# EAGLE design CombinedBoard_revA.1 (EAGLE 9.1.0)
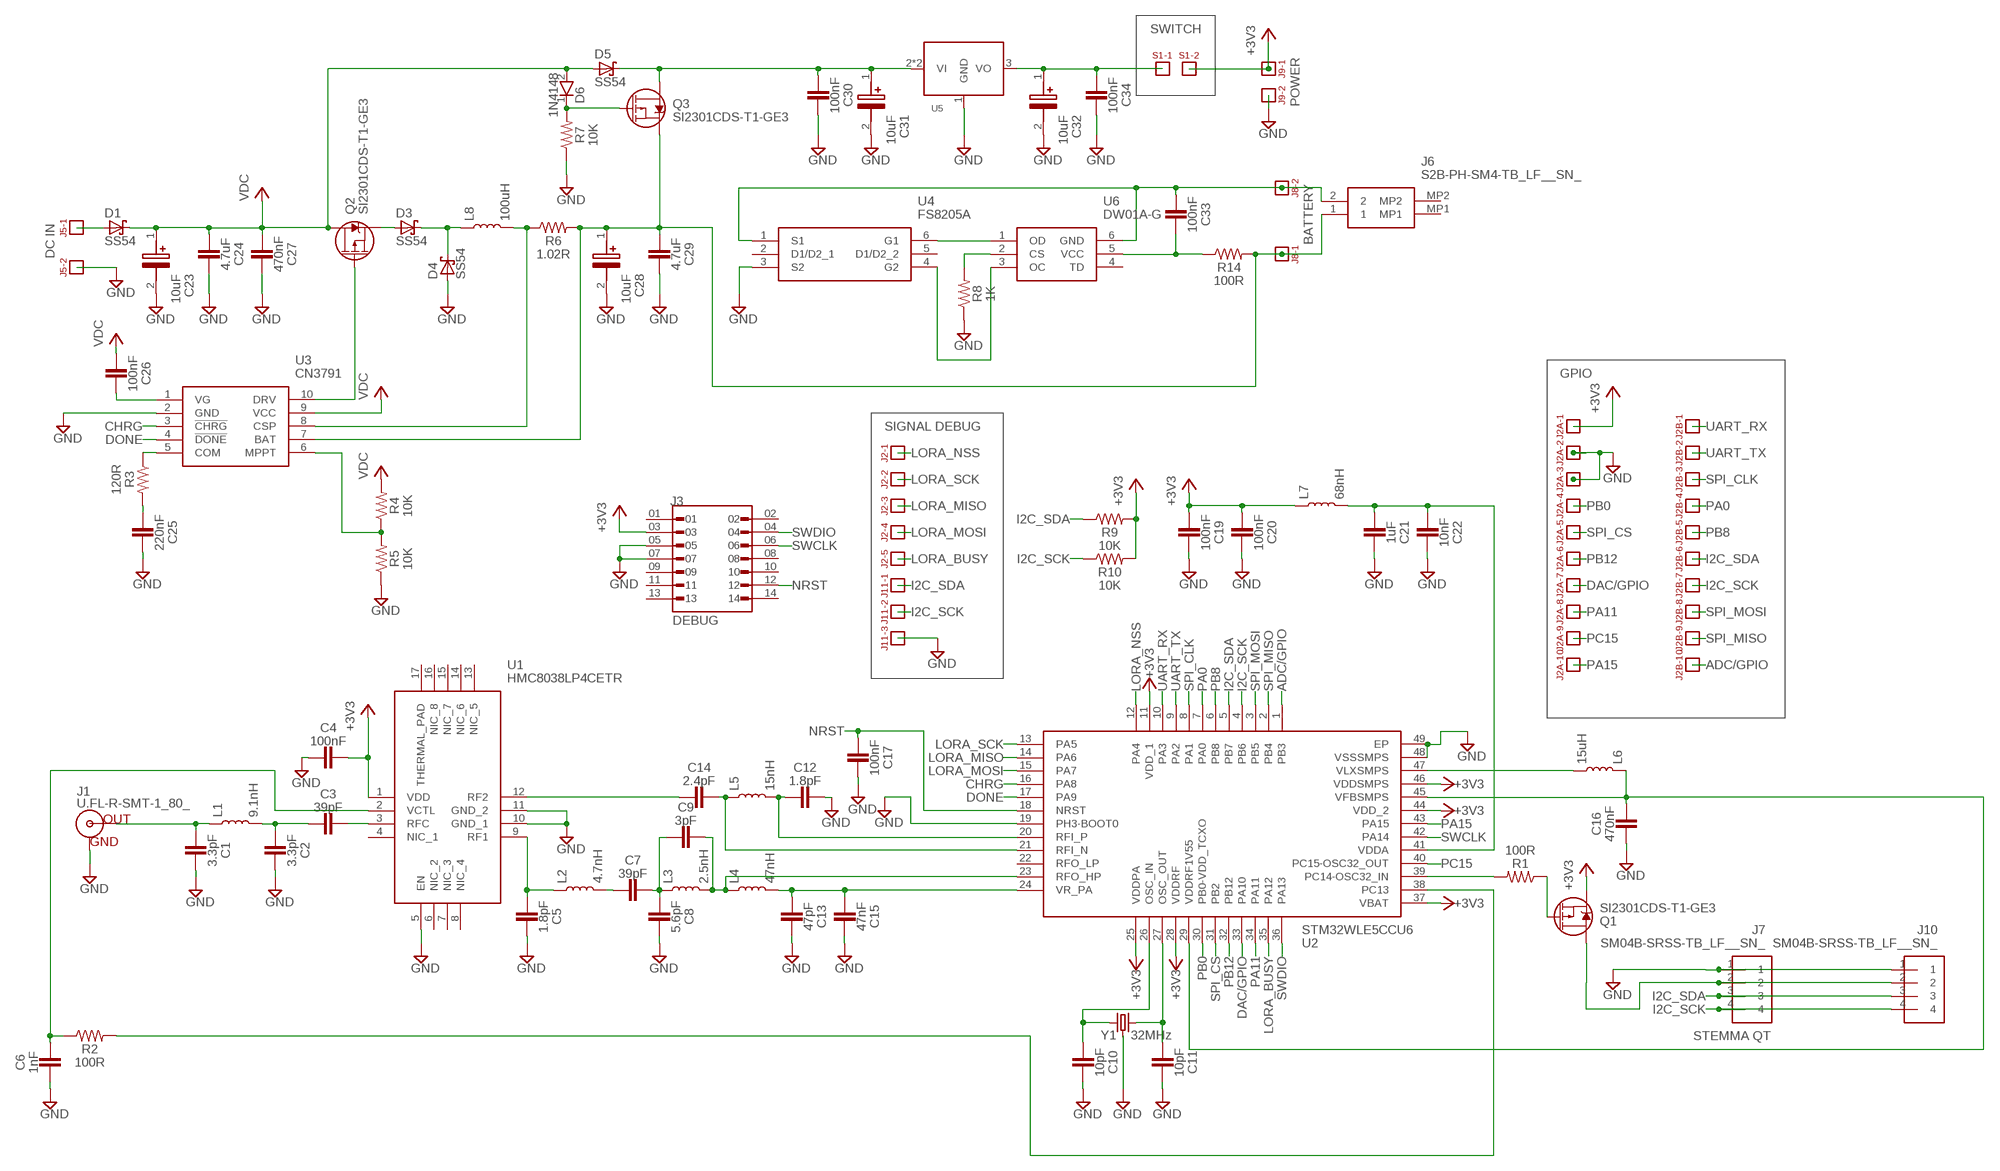
[diagram p0: schematic, sheet 1]

## Parts
C1  3.3pF  C_0402  [0402]
C2  3.3pF  C_0402  [0402]
C3  39pF  C_0402  [0402]
C4  100nF  C_0402  [0402]
C5  1.8pF  C_0402  [0402]
C6  1nF  C_0603  [0603]
C7  39pF  C_0402  [0402]
C8  5.6pF  C_0402  [0402]
C9  3pF  C_0603  [0603]
C10  10pF  C_0402  [0402]
C11  10pF  C_0402  [0402]
C12  1.8pF  C_0402  [0402]
C13  47pF  C_0603  [0603]
C14  2.4pF  C_0402  [0402]
C15  47nF  C_0603  [0603]
C16  470nF  C_0402  [0402]
C17  100nF  C_0402  [0402]
C19  100nF  C_0402  [0402]
C20  100nF  C_0402  [0402]
C21  1uF  C_0402  [0402]
C22  10nF  C_0402  [0402]
C23  10uF  4MM_SMD_ECAP  [4MM_SMD_ECAP]
C24  4.7uF  C_1206  [1206]
C25  220nF  C_0603  [0603]
C26  100nF  C_0402  [0402]
C27  470nF  C_0805  [0805]
C28  10uF  4MM_SMD_ECAP  [4MM_SMD_ECAP]
C29  4.7uF  C_1206  [1206]
C30  100nF  C_0402  [0402]
C31  10uF  4MM_SMD_ECAP  [4MM_SMD_ECAP]
C32  10uF  4MM_SMD_ECAP  [4MM_SMD_ECAP]
C33  100nF  C_0402  [0402]
C34  100nF  C_0402  [0402]
D1  SS54  DIODE_SCHOTTKY_SMA  [SMA(DO-214AC)]
D3  SS54  DIODE_SCHOTTKY_SMA  [SMA(DO-214AC)]
D4  SS54  DIODE_SCHOTTKY_SMA  [SMA(DO-214AC)]
D5  SS54  DIODE_SCHOTTKY_SMA  [SMA(DO-214AC)]
D6  1N4148  1N4148W  [SOD3716X135N]
J1  U.FL-R-SMT-1_80_  [UFLRSMT180]
J2  HEADER_5PIN  [HEADER_5PIN]
J2A  HEADER_10PIN  [HEADER_10PIN]
J2B  HEADER_10PIN  [HEADER_10PIN]
J3  DEBUG  HEADER_DEBUG_SMD  [HEADER_DEBUG_SMD]
J5  SOLAR  HEADER_2PIN  [HEADER_2PIN]
J6  S2B-PH-SM4-TB_LF__SN_  [S2BPHSM4TBLFSN]
J7  SM04B-SRSS-TB_LF__SN_  [SM04B-SRSS-TB(LFSN)]
J8  BATTERY  HEADER_2PIN  [HEADER_2PIN]
J9  POWER  HEADER_2PIN  [HEADER_2PIN]
J10  SM04B-SRSS-TB_LF__SN_  [SM04B-SRSS-TB(LFSN)]
J11  HEADER_3PIN  [HEADER_3PIN]
L1  9.1nH  L_0402  [0402]
L2  4.7nH  L_0402  [0402]
L3  2.5nH  L_0402  [0402]
L4  47nH  L_0603  [0603]
L5  15nH  L_0402  [0402]
L6  15uH  L_0805  [0805]
L7  68nH  L_0603  [0603]
L8  100uH  L_SMD,7X7.8MM  [L_SMD,7X7.8MM]
Q1  SI2301CDS-T1-GE3  MOSFET_P_SOT23  [SOT-23]
Q2  SI2301CDS-T1-GE3  MOSFET_P_SOT23  [SOT-23]
Q3  SI2301CDS-T1-GE3  MOSFET_P_SOT23  [SOT-23]
R1  100R  R_0402  [0402]
R2  100R  R_0402  [0402]
R3  120R  R_0805  [0805]
R4  10K  R_0402  [0402]
R5  10K  R_0402  [0402]
R6  1.02R  R_1206  [1206]
R7  10K  R_0402  [0402]
R8  1K  R_0402  [0402]
R9  10K  R_0402  [0402]
R10  10K  R_0402  [0402]
R14  100R  R_0402  [0402]
S1  HEADER_2PIN  [HEADER_2PIN]
U1  HMC8038LP4CETR  [QFN65P400X400X90-17N]
U2  STM32WLE5CCU6  [QFN50P700X700X60-49N]
U3  CN3791  [SOP100P600X175-10N]
U4  FS8205A  [SOT95P280X125-6N]
U5  LDO_SOT89  [SOT-89-3]
U6  DW01A-G  [SOT95P280X135-6N]
Y1  32MHz  XTAL_SMD2016-4P  [SMD2016-4P]

## Nets
+3V3: C4.2 C19.1 C20.1 J2A.P$1 J3.03 J9.P$1 L7.1 Q1.3(S) R9.2 R10.2 S1.P$2 U1.1(VDD) U2.11(VDD_1) U2.25(VDDPA) U2.28(VDDRF) U2.37(VBAT) U2.44(VDD_2) U2.46(VDDSMPS)
ADC/GPIO: J2B.P$10 U2.1(PB3)
B+: C28.1(+) C29.1 J6.1 J8.P$1 Q3.3(S) R6.2 R14.2 U3.7(BAT)
B-: C33.1 J6.2 J8.P$2 U4.1(S1) U6.6(GND)
CHRG: U2.16(PA8) U3.3(!CHRG)
DAC/GPIO: J2A.P$7 U2.33(PA10)
DONE: U2.17(PA9) U3.4(!DONE)
GND: C1.2 C2.2 C4.1 C5.2 C6.1 C8.2 C10.2 C11.2 C12.2 C13.2 C15.2 C16.1 C17.2 C19.2 C20.2 C21.2 C22.2 C23.2(-) C24.2 C25.2 C27.2 C28.2(-) C29.2 C30.2 C31.2(-) C32.2(-) C34.2 D4.2(A) J1.2(GND) J1.3(GND) J2A.P$2 J2A.P$3 J3.05 J3.07 J5.P$2 J7.1 J9.P$2 J10.1 J11.P$3 R5.1 R7.1 R8.1 U1.5(EN) U1.10(GND_1) U1.11(GND_2) U2.19(PH3-BOOT0) U2.48(VSSSMPS) U2.49(EP) U3.2(GND) U4.3(S2) U5.1(GND) Y1.2 Y1.4
I2C_SCK: J2B.P$7 J7.4 J10.4 J11.P$2 R10.1 U2.4(PB6)
I2C_SDA: J2B.P$6 J7.3 J10.3 J11.P$1 R9.1 U2.5(PB7)
LORA_BUSY: J2.P$5 U2.35(PA12)
LORA_MISO: J2.P$3 U2.14(PA6)
LORA_MOSI: J2.P$4 U2.15(PA7)
LORA_NSS: J2.P$1 U2.12(PA4)
LORA_SCK: J2.P$2 U2.13(PA5)
N$1: D3.2(A) Q2.3(S)
N$2: C9.2 L3.2 L4.1 U2.23(RFO_HP)
N$3: C14.2 L5.1 U2.21(RFI_N)
N$4: L6.2 U2.47(VLXSMPS)
N$5: R2.2 U2.38(PC13)
N$6: D6.1(K) Q3.1(G) R7.2
N$7: D1.2(A) J5.P$1
N$8: R1.2 U2.39(PC14-OSC32_IN)
N$9: Q1.1(G) R1.1
N$10: C32.1(+) C34.1 S1.P$1 U5.3(VO)
N$12: J7.2 J10.2 Q1.2(D)
N$23: D3.1(C) D4.1(C) L8.P$1
N$24: L8.P$2 R6.1 U3.8(CSP)
N$25: C30.1 C31.1(+) D5.1(C) Q3.2(D) U5.2(VI) U5.4(VI)
N$26: Q2.1(G) U3.10(DRV)
N$27: R3.1 U3.5(COM)
N$28: C25.1 R3.2
N$31: C26.2 U3.1(VG)
N$32: R4.1 R5.2 U3.6(MPPT)
N$33: R8.2 U6.2(CS)
N$34: U4.4(G2) U6.3(OC)
N$35: U4.6(G1) U6.1(OD)
N$37: C33.2 R14.1 U6.5(VCC)
N$49: C1.1 J1.1(OUT) L1.1
N$50: C2.1 C3.1 L1.2
N$51: C3.2 U1.3(RFC)
N$52: C6.2 R2.1 U1.2(VCTL)
N$53: C14.1 U1.12(RF2)
N$54: C5.1 L2.1 U1.9(RF1)
N$55: C7.1 L2.2
N$56: C7.2 C8.1 C9.1 L3.1
NRST: C17.1 J3.12 U2.18(NRST)
OSC_IN: C10.1 U2.26(OSC_IN) Y1.1
OSC_OUT: C11.1 U2.27(OSC_OUT) Y1.3
PA0: J2B.P$4 U2.7(PA0)
PA11: J2A.P$8 U2.34(PA11)
PA15: J2A.P$10 U2.43(PA15)
PB0: J2A.P$4 U2.30(PB0-VDD_TCXO)
PB8: J2B.P$5 U2.6(PB8)
PB12: J2A.P$6 U2.32(PB12)
PC15: J2A.P$9 U2.40(PC15-OSC32_OUT)
RFI_3: C12.1 L5.2 U2.20(RFI_P)
SPI_CLK: J2B.P$3 U2.8(PA1)
SPI_CS: J2A.P$5 U2.31(PB2)
SPI_MISO: J2B.P$9 U2.2(PB4)
SPI_MOSI: J2B.P$8 U2.3(PB5)
SWCLK: J3.06 U2.42(PA14)
SWDIO: J3.04 U2.36(PA13)
UART_RX: J2B.P$1 U2.10(PA3)
UART_TX: J2B.P$2 U2.9(PA2)
VDC: C23.1(+) C24.1 C26.1 C27.1 D1.1(C) D5.2(A) D6.2(A) Q2.2(D) R4.2 U3.9(VCC)
VDDA: C21.1 C22.1 L7.2 U2.41(VDDA)
VR_PA1: C13.1 C15.1 L4.2 U2.24(VR_PA)
VREG1: C16.2 L6.1 U2.29(VDDRF1V55) U2.45(VFBSMPS)
Unconnected: J3.01 J3.02 J3.08 J3.09 J3.10 J3.11 J3.13 J3.14 J6.MP1 J6.MP2 U1.4(NIC_1) U1.6(NIC_2) U1.7(NIC_3) U1.8(NIC_4) U1.13(NIC_5) U1.14(NIC_6) U1.15(NIC_7) U1.16(NIC_8) U1.17(THERMAL_PAD) U2.22(RFO_LP) U4.2(D1/D2_1) U4.5(D1/D2_2) U6.4(TD)

## Notes on the sheet
- SWITCH
- POWER
- BATTERY
- DC IN
- GPIO
- SIGNAL DEBUG
- STEMMA QT

## Library data of the parts
C1-C5 C7 C8 C10-C12 C14 C16 C17 C19-C22 C26 C30 C33 C34 = NSE LABS:C_0402: Samsung Source: Datasheet <https://datasheet.lcsc.com/szlcsc/Samsung-Electro-Mechanics-CL05B104KB54PNC_C307331.pdf>
C6 C9 C13 C15 C25 = NSE LABS:C_0603
C23 C28 C31 C32 = NSE LABS:4MM_SMD_ECAP
C24 C29 = NSE LABS:C_1206
C27 = NSE LABS:C_0805
D1 D3-D5 = NSE LABS:DIODE_SCHOTTKY_SMA
D6 = MARA MACHINES:1N4148W: Diode Switching 100V 0.15A SOD123 Vishay 1N4148W-E3-08 Switching Diode, 150mA 75V, 2-Pin SOD-123 Source: Datasheet <http://www.vishay.com/docs/85748/1n4148w.pdf>; ARROW_PART_NUMBER: 1N4148W-E3-08; ARROW_PRICE-STOCK: https://www.arrow.com/en/products/1n4148w-e3-08/vishay; DESCRIPTION: Diode Switching 100V 0.15A SOD123 Vishay 1N4148W-E3-08 Switching Diode, 150mA 75V, 2-Pin SOD-123; HEIGHT: 1.35mm; MANUFACTURER_NAME: Vishay; MANUFACTURER_PART_NUMBER: 1N4148W-E3-08; MOUSER_PART_NUMBER: 78-1N4148W-E3-08; MOUSER_PRICE-STOCK: https://www.mouser.co.uk/ProductDetail/Vishay-Semiconductors/1N4148W-E3-08/?qs=bTzheeSci6TVjpxfjjRVMw%3D%3D
J1 = NSE LABS:U.FL-R-SMT-1_80_: RF Connectors/Coaxial Connectors SMD RoHS Source: Datasheet <https://www.hirose.com/product/download/?distributor=digikey&type=2d&lang=en&num=U.FL-R-SMT-1(80)>; DESCRIPTION: RF Connectors/Coaxial Connectors SMD RoHS; HEIGHT: 1.45mm; MANUFACTURER_NAME: Hirose; MANUFACTURER_PART_NUMBER: U.FL-R-SMT-1(80); MOUSER_PART_NUMBER: 798-UFLRSMT180; MOUSER_PRICE-STOCK: https://www.mouser.co.uk/ProductDetail/Hirose-Connector/U.FL-R-SMT-180?qs=PABxe4V6HDqFClp15N8Kig%3D%3D
J2 = NSE LABS:HEADER_5PIN
J2A J2B = NSE LABS:HEADER_10PIN
J3 = NSE LABS:HEADER_DEBUG_SMD
J5 J8 J9 S1 = NSE LABS:HEADER_2PIN
J6 = NSE LABS:S2B-PH-SM4-TB_LF__SN_: Conn Shrouded Header (4 Sides) HDR 2 POS 2mm Solder RA Side Entry SMD T/R Source: Datasheet <https://www.jst-mfg.com/product/pdf/eng/ePH.pdf>; ARROW_PART_NUMBER: S2B-PH-SM4-TB(LF)(SN); ARROW_PRICE-STOCK: https://www.arrow.com/en/products/s2b-ph-sm4-tb-lf-sn/jst-manufacturing?region=europe; DESCRIPTION: Conn Shrouded Header (4 Sides) HDR 2 POS 2mm Solder RA Side Entry SMD T/R; HEIGHT: 6.6mm; MANUFACTURER_NAME: JST (JAPAN SOLDERLESS TERMINALS); MANUFACTURER_PART_NUMBER: S2B-PH-SM4-TB(LF)(SN)
J7 J10 = NSE LABS:SM04B-SRSS-TB_LF__SN_: JST (JAPAN SOLDERLESS TERMINALS) - SM04B-SRSS-TB(LF)(SN) - CONNECTOR, HEADER, SMT, R/A, 1MM, 4WAY Source: Datasheet <http://www.jst-mfg.com/product/pdf/eng/eSH.pdf>; ARROW_PART_NUMBER: SM04B-SRSS-TB(LF)(SN); ARROW_PRICE-STOCK: https://www.arrow.com/en/products/sm04b-srss-tb-lf-sn/jst-manufacturing?region=europe; DESCRIPTION: JST (JAPAN SOLDERLESS TERMINALS) - SM04B-SRSS-TB(LF)(SN) - CONNECTOR, HEADER, SMT, R/A, 1MM, 4WAY; HEIGHT: mm; MANUFACTURER_NAME: JST (JAPAN SOLDERLESS TERMINALS); MANUFACTURER_PART_NUMBER: SM04B-SRSS-TB(LF)(SN)
J11 = NSE LABS:HEADER_3PIN
L1-L3 L5 = NSE LABS:L_0402
L4 L7 = NSE LABS:L_0603
L6 = NSE LABS:L_0805
L8 = NSE LABS:L_SMD,7X7.8MM
Q1-Q3 = NSE LABS:MOSFET_P_SOT23
R1 R2 R4 R5 R7-R10 R14 = NSE LABS:R_0402
R3 = NSE LABS:R_0805
R6 = NSE LABS:R_1206
U1 = NSE LABS:HMC8038LP4CETR: RF Switch ICs High isolation, non-reflective, single s Source: Datasheet <https://pt.mouser.com/datasheet/2/609/HMC8038W-2956082.pdf>; ARROW_PART_NUMBER: HMC8038LP4CETR; ARROW_PRICE-STOCK: https://www.arrow.com/en/products/hmc8038lp4cetr/analog-devices?region=nac; DESCRIPTION: RF Switch ICs High isolation, non-reflective, single s; HEIGHT: 0.9mm; MANUFACTURER_NAME: Analog Devices; MANUFACTURER_PART_NUMBER: HMC8038LP4CETR; MOUSER_PART_NUMBER: 584-HMC8038LP4CETR; MOUSER_PRICE-STOCK: https://www.mouser.co.uk/ProductDetail/Analog-Devices/HMC8038LP4CETR?qs=JeIcUl65ClBZnat%2FltI6ww%3D%3D
U2 = NSE LABS:STM32WLE5CCU6: STM32WLE5CCU6 Source: Datasheet <https://www.mouser.ch/datasheet/2/389/stm32wle5c8-1903151.pdf>; ARROW_PART_NUMBER: STM32WLE5CCU6; ARROW_PRICE-STOCK: https://www.arrow.com/en/products/stm32wle5ccu6/stmicroelectronics?region=nac; DESCRIPTION: STM32WLE5CCU6; HEIGHT: 0.6mm; MANUFACTURER_NAME: STMicroelectronics; MANUFACTURER_PART_NUMBER: STM32WLE5CCU6; MOUSER_PART_NUMBER: 511-STM32WLE5CCU6; MOUSER_PRICE-STOCK: https://www.mouser.co.uk/ProductDetail/STMicroelectronics/STM32WLE5CCU6?qs=26oI9%252Bq63sLM90C6xjPI1g%3D%3D
U3 = NSE LABS:CN3791: ic Source: Datasheet <http://www.consonance-elec.com/pdf/datasheet/DSE-CN3791.pdf>; DESCRIPTION: ic; HEIGHT: 1.75mm; MANUFACTURER_NAME: Consonance; MANUFACTURER_PART_NUMBER: CN3791
U4 = NSE LABS:FS8205A: Dual N-Channel Enhancement Power Mosfet Source: Datasheet <http://www.techpublic.com.tw/pdf/FS8205A.pdf>; DESCRIPTION: Dual N-Channel Enhancement Power Mosfet; HEIGHT: 1.25mm; MANUFACTURER_NAME: TECH PUBLIC; MANUFACTURER_PART_NUMBER: FS8205A
U5 = NSE LABS:LDO_SOT89
U6 = NSE LABS:DW01A-G: One Cell Lithium-ion/Polymer Battery Protection IC Source: Datasheet <http://acoptex.com/uploads/DW01A.pdf>; DESCRIPTION: One Cell Lithium-ion/Polymer Battery Protection IC; HEIGHT: 1.35mm; MANUFACTURER_NAME: Fortune Semiconductor Corporation; MANUFACTURER_PART_NUMBER: DW01A-G
Y1 = NSE LABS:XTAL_SMD2016-4P

## Board
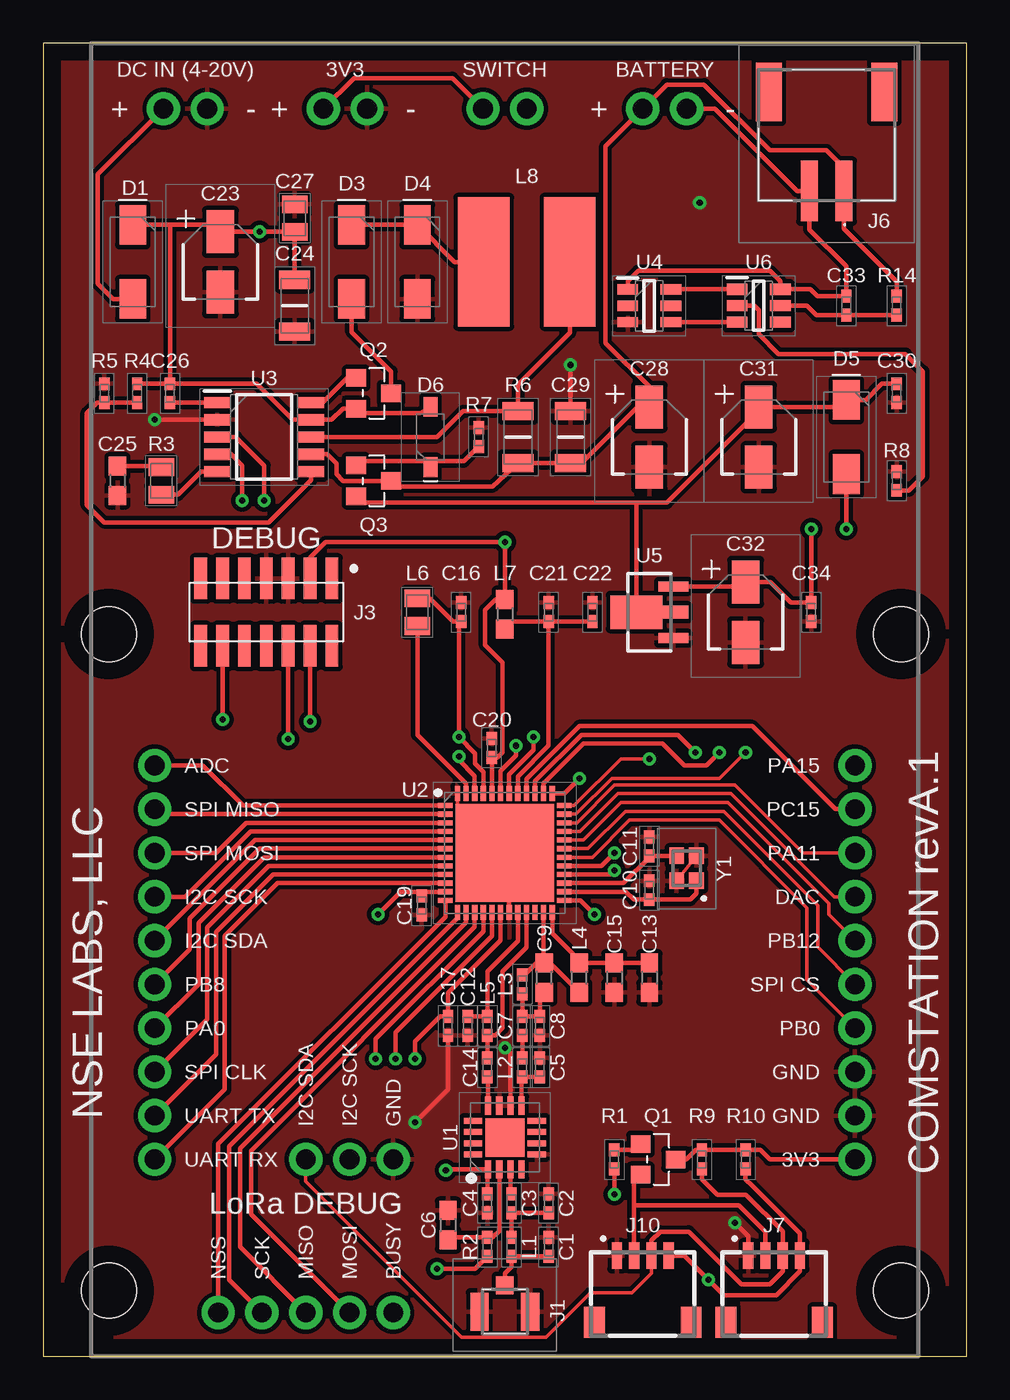
[diagram p1: board, top side]
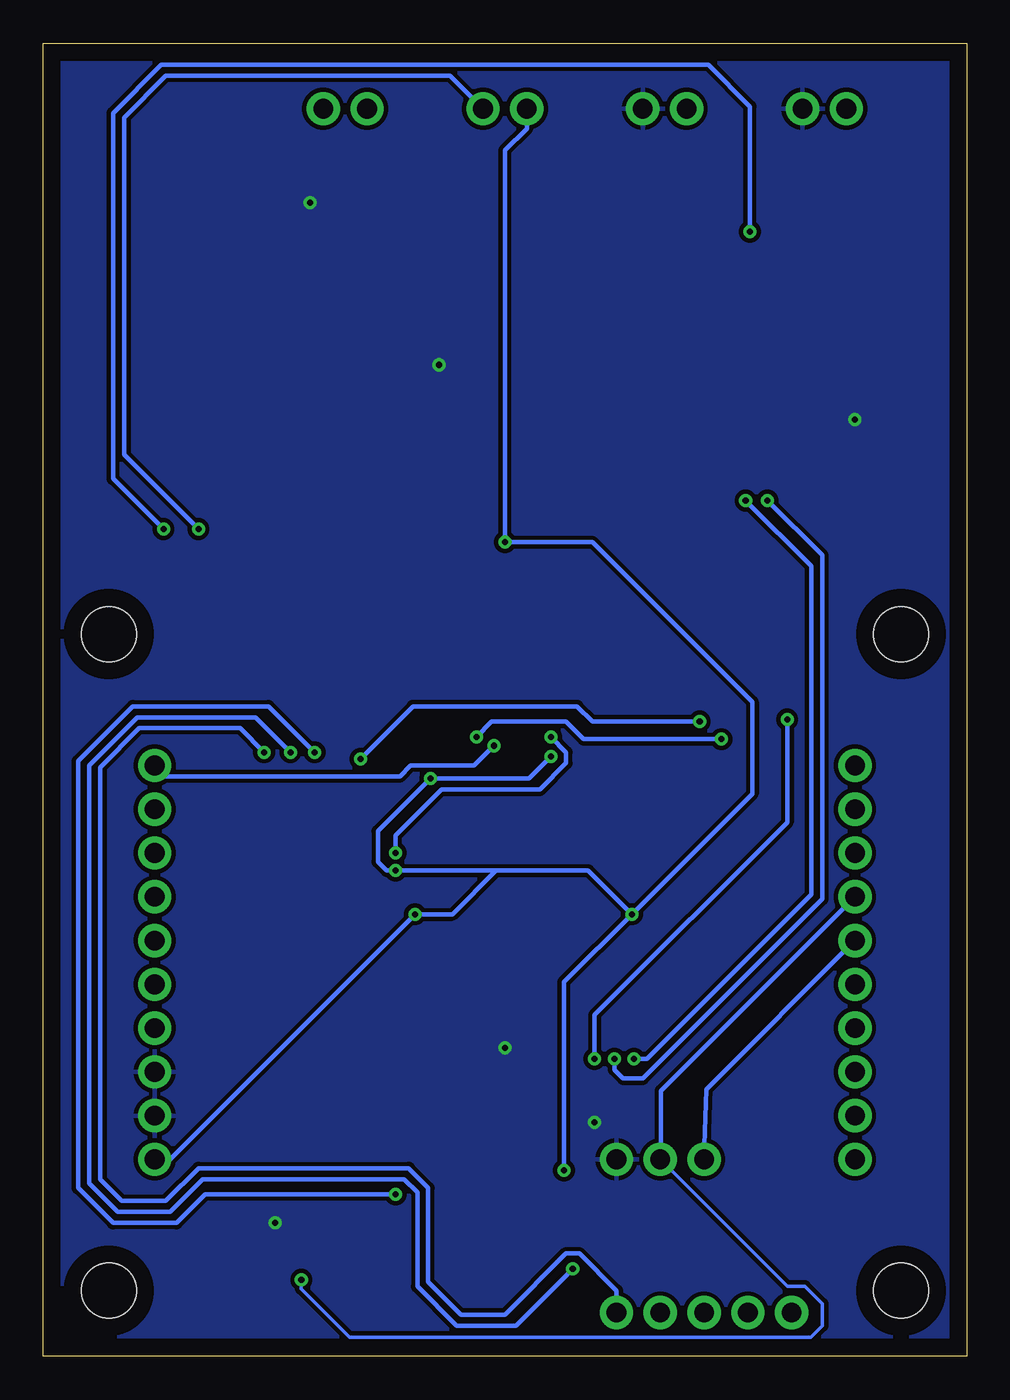
[diagram p2: board, bottom side, seen from below]

Size 53.59 x 76.2 mm. Coordinates in mm from the lower left corner, seen from the top.
Outline: 0,0 53.59,0 53.59,76.2 0,76.2 0,0
Copper layers (1*16): Top 0.035mm / dielectric 1.5mm / Bottom 0.035mm
Design rules "default": minimum track width 6mil, minimum drill 0.35mm, track to track 6mil, track to pad 6mil, pad to pad 6mil, via to via 6mil, smd to smd 6mil, copper to edge 40mil, drill to drill 6mil, minimum pad ring 10mil, minimum via ring 8mil, stop-mask expansion 4mil, vias tented up to drill 0mil, thermal gap 10mil
Holes 3.17 mm at 49.78,3.81 49.78,41.91 3.81,41.91 3.81,3.81

### Footprints (pad centres in the part's own frame; a part is rotated, then mirrored left to right if it is on the bottom)
0402 = smd 0.75 x 0.6: 1 -0.55,0; 2 0.55,0
0603 = smd 1.1 x 1: 1 -0.85,0; 2 0.85,0
4MM_SMD_ECAP = smd 2.5 x 1.6: 1 -1.75,0; 2 1.75,0
1206 = smd 1.05 x 1.8: 1 -1.5,0; 2 1.5,0
0805 = smd 1.02 x 1.47: 1 -0.8,0; 2 0.8,0
SMA(DO-214AC) = smd 2.3 x 1.55: 1 -2.15,0; 2 2.15,0
SOD3716X135N = smd 1.15 x 0.8: 1 -1.75,0; 2 1.75,0
UFLRSMT180 = smd 1 x 1.05: 1 0,-0.825 | smd 1.05 x 2.2: 2 -1.475,0.7; 3 1.475,0.7
HEADER_5PIN = drill 1.143 pad 1.93: P$1 -5.08,0; P$2 -2.54,0; P$3 0,0; P$4 2.54,0; P$5 5.08,0
HEADER_10PIN = drill 1.143 pad 1.93: P$1 -11.43,0; P$2 -8.89,0; P$3 -6.35,0; P$4 -3.81,0; P$5 -1.27,0; P$6 1.27,0; P$7 3.81,0; P$8 6.35,0; P$9 8.89,0; P$10 11.43,0
HEADER_DEBUG_SMD = smd 0.737 x 2.413: 01 -3.81,-1.956; 02 -3.81,1.956; 03 -2.54,-1.956; 04 -2.54,1.956; 05 -1.27,-1.956; 06 -1.27,1.956; 07 0,-1.956; 08 0,1.956; 09 1.27,-1.956; 10 1.27,1.956; 11 2.54,-1.956; 12 2.54,1.956; 13 3.81,-1.956; 14 3.81,1.956
HEADER_2PIN = drill 1.143 pad 1.93: P$1 -1.27,0; P$2 1.27,0
S2BPHSM4TBLFSN = smd 1 x 3.5: 1 1,-3.25; 2 -1,-3.25 | smd 1.5 x 3.4: MP1 3.35,2.5; MP2 -3.35,2.5
SM04B-SRSS-TB(LFSN) = smd 0.6 x 1.55: 1 -1.5,2.161; 2 -0.5,2.161; 3 0.5,2.161; 4 1.5,2.161 | smd 1.2 x 1.8: 5 -2.8,-1.714; 6 2.8,-1.714
HEADER_3PIN = drill 1.143 pad 1.93: P$1 -2.54,0; P$2 0,0; P$3 2.54,0
L_SMD,7X7.8MM = smd 3 x 7.5: P$1 -2.5,0; P$2 2.5,0
SOT-23 = smd 1.016 x 1.143: 1 -0.889,-1.016; 2 0.889,-1.016; 3 0,1.016
QFN65P400X400X90-17N = smd 1.05 x 0.35: 1 -1.85,0.975; 2 -1.85,0.325; 3 -1.85,-0.325; 4 -1.85,-0.975; 9 1.85,-0.975; 10 1.85,-0.325; 11 1.85,0.325; 12 1.85,0.975 | smd 0.35 x 1.05: 5 -0.975,-1.85; 6 -0.325,-1.85; 7 0.325,-1.85; 8 0.975,-1.85; 13 0.975,1.85; 14 0.325,1.85; 15 -0.325,1.85; 16 -0.975,1.85 | smd 2.25 x 2.25: 17 0,0
QFN50P700X700X60-49N = smd 0.85 x 0.3: 1 -3.45,2.75; 2 -3.45,2.25; 3 -3.45,1.75; 4 -3.45,1.25; 5 -3.45,0.75; 6 -3.45,0.25; 7 -3.45,-0.25; 8 -3.45,-0.75; 9 -3.45,-1.25; 10 -3.45,-1.75; 11 -3.45,-2.25; 12 -3.45,-2.75; 25 3.45,-2.75; 26 3.45,-2.25; 27 3.45,-1.75; 28 3.45,-1.25; 29 3.45,-0.75; 30 3.45,-0.25; 31 3.45,0.25; 32 3.45,0.75; 33 3.45,1.25; 34 3.45,1.75; 35 3.45,2.25; 36 3.45,2.75 | smd 0.3 x 0.85: 13 -2.75,-3.45; 14 -2.25,-3.45; 15 -1.75,-3.45; 16 -1.25,-3.45; 17 -0.75,-3.45; 18 -0.25,-3.45; 19 0.25,-3.45; 20 0.75,-3.45; 21 1.25,-3.45; 22 1.75,-3.45; 23 2.25,-3.45; 24 2.75,-3.45; 37 2.75,3.45; 38 2.25,3.45; 39 1.75,3.45; 40 1.25,3.45; 41 0.75,3.45; 42 0.25,3.45; 43 -0.25,3.45; 44 -0.75,3.45; 45 -1.25,3.45; 46 -1.75,3.45; 47 -2.25,3.45; 48 -2.75,3.45 | smd 5.7 x 5.7: 49 0,0
SOP100P600X175-10N = smd 1.525 x 0.65: 1 -2.712,2; 2 -2.712,1; 3 -2.712,0; 4 -2.712,-1; 5 -2.712,-2; 6 2.712,-2; 7 2.712,-1; 8 2.712,0; 9 2.712,1; 10 2.712,2
SOT95P280X125-6N = smd 1.2 x 0.6: 1 -1.25,0.95; 2 -1.25,0; 3 -1.25,-0.95; 4 1.25,-0.95; 5 1.25,0; 6 1.25,0.95
SOT-89-3 = smd 0.58 x 1.73: 1 -1.5,-1.4; 3 1.5,-1.4 | smd 0.76 x 1.5: 2 0,-1.515 | smd 1.933 x 3.03: 4 0,0.75
SOT95P280X135-6N = smd 1.2 x 0.65: 1 -1.25,0.95; 2 -1.25,0; 3 -1.25,-0.95; 4 1.25,-0.95; 5 1.25,0; 6 1.25,0.95
SMD2016-4P = smd 0.95 x 0.85: 1 -0.725,-0.575; 2 0.725,-0.575; 3 0.725,0.575; 4 -0.725,0.575

### Placement (x,y rotation side)
C1  29.34,6.35 90 top
C2  29.34,8.89 90 top
C3  27.18,8.89 90 top
C4  25.78,8.89 90 top
C5  28.83,16.76 90 top
C6  23.5,7.62 270 top
C7  27.81,19.18 90 top
C8  28.83,19.18 270 top
C9  29.08,21.97 90 top
C10  35.18,27.05 90 top
C11  35.18,29.59 90 top
C12  24.64,19.18 270 top
C13  35.18,21.97 270 top
C14  25.78,16.76 90 top
C15  33.15,21.97 270 top
C16  24.26,43.18 270 top
C17  23.5,19.18 270 top
C19  21.97,26.16 270 top
C20  26.04,35.31 90 top
C21  29.34,43.18 90 top
C22  31.88,43.18 90 top
C23  10.29,63.5 270 top
C24  14.61,60.96 270 top
C25  4.32,50.8 270 top
C26  7.37,55.88 270 top
C27  14.61,66.04 90 top
C28  35.18,53.34 270 top
C29  30.61,53.34 90 top
C30  49.53,55.88 270 top
C31  41.53,53.34 270 top
C32  40.77,43.18 270 top
C33  46.61,60.96 270 top
C34  44.58,43.18 270 top
D1  5.21,63.5 270 top
D3  17.91,63.5 270 top
D4  21.72,63.5 270 top
D5  46.61,53.34 270 top
D6  22.48,53.34 90 top
J1  26.8,3.3 180 top
J2  15.24,2.54 0 top
J2A  47.12,22.86 90 top
J2B  6.48,22.86 90 top
J3  12.95,43.18 180 top
J5  8.26,72.39 0 top
J6  45.47,70.87 0 top
J7  42.42,3.68 0 top
J8  36.07,72.39 0 top
J9  17.53,72.39 0 top
J10  34.8,3.68 0 top
J11  17.78,11.43 0 top
L1  27.18,6.35 90 top
L2  27.81,16.76 90 top
L3  27.81,21.59 90 top
L4  31.11,21.97 90 top
L5  25.78,19.18 90 top
L6  21.72,43.18 270 top
L7  26.8,43.05 270 top
L8  28.07,63.5 0 top
Q1  35.69,11.43 270 top
Q2  19.18,55.88 270 top
Q3  19.18,50.8 270 top
R1  33.15,11.43 270 top
R2  25.78,6.35 270 top
R3  6.86,50.8 90 top
R4  5.46,55.88 90 top
R5  3.56,55.88 270 top
R6  27.56,53.34 270 top
R7  25.27,53.34 270 top
R8  49.53,50.8 270 top
R9  38.23,11.43 90 top
R10  40.77,11.43 90 top
R14  49.53,60.96 90 top
S1  26.8,72.39 180 top
U1  26.8,12.7 90 top
U2  26.8,29.21 0 top
U3  12.83,53.34 0 top
U4  35.18,60.96 0 top
U5  35.18,43.18 90 top
U6  41.53,60.96 0 top
Y1  37.34,28.32 90 top

### Tracks (layer width: path | path; a pad name or v marks a point on that pad's centre or on a via)
+3V3  (via drill 0.35)
  Top 0.254: C4.2 25.78,10.81 U1.1 23.42,10.85 v23.37,10.79 | J9.P$1 18.03,74.17 23.75,74.17 S1.P$2 | C20.1 26.05,34.74 | U2.28 32.91,27.96 v33.15,28.19 | U2.25 31.2,26.46 v32,25.65 | U2.46 25.05,33.69 24.13,34.6 v24.13,34.8 | v31.11,33.53 30.25,32.66 U2.37 | U2.11 21.97,26.96 | 21.97,26.96 20.74,26.96 v19.43,25.65 | C19.1 21.97,26.96 | J3.03 15.49,46.35 16.38,47.24 v26.8,47.24 L7.1 26.25,43.9 25.65,43.31 25.65,41.27 26.67,40.26 26.67,35.05 26.37,34.76 C20.1 | U2.44 26.05,34.74 | 26.05,34.74 C20.1 | J2A.P$1 42.16,11.43 41.61,11.98 R10.2 R9.2 37.89,11.98 37.34,11.43 Q1.3
  Bottom 0.254: S1.P$2 25.53,71.25 26.8,69.98 v26.8,47.24 21.72,47.24 12.45,37.97 12.45,32.64 v19.43,25.65 | v24.13,34.8 25.4,33.53 v31.11,33.53 34.16,30.48 34.16,28.7 33.66,28.19 v33.15,28.19 27.3,28.19 | J2A.P$1 46.23,11.43 v32,25.65 29.84,25.65 27.3,28.19 | 27.3,28.19 21.97,28.19 v19.43,25.65 | v23.37,10.79 23.37,21.72 v19.43,25.65
ADC/GPIO
  Top 0.254: U2.1 11.6,31.96 9.27,34.29 J2B.P$10
B+
  Top 0.254: U3.7 16.49,52.34 17.02,51.82 17.02,51.18 17.4,50.8 Q3.3 20.51,50.48 26.07,50.48 R6.2 C29.1 31.24,51.84 34.49,55.09 C28.1 35.18,56.26 32.64,58.8 32.64,70.23 J8.P$1 36.2,73.79 38.35,73.79 42.16,69.98 45.47,69.98 46.47,68.98 J6.1 46.47,65.42 49.53,62.36 R14.2
B-
  Top 0.254: U4.1 33.93,62.38 34.54,62.99 34.8,62.99 42.16,62.99 42.78,62.38 U6.6 44.52,61.91 44.92,61.51 C33.1 46.61,63.25 44.47,65.39 J6.2 43.76,67.62 38.99,72.39 J8.P$2
CHRG  (via drill 0.35)
  Top 0.254: U2.16 25.55,24.66 19.3,18.41 v19.3,17.27 | v12.83,49.66 12.83,51.69 11.18,53.34 U3.3
  Bottom 0.254: v12.83,49.66 9.02,45.85 9.02,26.8 18.54,17.27 v19.3,17.27
DAC/GPIO
  Top 0.203: U2.33 31.16,30.46 33.36,32.66 39.92,32.66 45.91,26.67 J2A.P$7
DONE  (via drill 0.35)
  Top 0.254: U2.17 26.05,24.4 20.45,18.8 v20.45,17.27 | v11.56,49.66 11.56,51.69 10.91,52.34 U3.4
  Bottom 0.254: v20.45,17.27 20.45,16.64 19.94,16.13 18.8,16.13 8.38,26.54 8.38,46.48 v11.56,49.66
GND  (via drill 0.35)
  Top 0.203: U2.48 24.05,31.83 27.05,28.83 | Y1.4 Y1.2
  Top 0.254: U3.2 6.49,54.34 v6.48,54.36 | U2.19 27.05,28.83 27.05,28.96 U2.49 | U1.10 27.12,17.58 v26.8,17.91 | C17.2 23.5,15.49 v21.59,13.59 | C29.2 v30.61,57.53 | J7.1 40.92,6.96 v40.13,7.75
  other vias: 38.1,66.93
  pour Bottom (isolate 0.254): 0,0 53.59,0 53.59,76.2 0,76.2
  pour Top (isolate 0.254): 0,0 53.59,0 53.59,76.2 0,76.2
I2C_SCK  (via drill 0.35)
  Top 0.254: U2.4 12.04,30.46 8.26,26.67 J2B.P$7 | R10.1 40.77,10.29 41.15,9.91 43.92,7.14 J7.4 43.92,4.93 42.55,3.56 39.5,3.56 v38.61,4.45 37.21,5.84 J10.4
  Bottom 0.203: v38.61,4.45 38.61,3.91 35.81,1.12 9.04,1.12 8.38,1.78 8.38,3.05 9.4,4.06 10.41,4.06 J11.P$2
  Bottom 0.254: J2B.P$7 17.74,15.41 17.74,11.47 J11.P$2
I2C_SDA
  Top 0.203: J11.P$1 15.24,10.16 24.28,1.12 29.18,1.12 31.75,3.68 34.16,3.68 35.3,4.82 J10.3
  Top 0.254: U2.5 12.31,29.96 J2B.P$6 | R9.1 38.23,10.29 39.14,9.37 40.79,9.37 42.92,7.25 J7.3 42.92,4.95 42.16,4.19 40.51,4.19 37.47,7.24 35.81,7.24 35.3,6.72 J10.3
  Bottom 0.254: J11.P$1 15.11,15.49 J2B.P$6
LORA_BUSY  (via drill 0.35)
  Top 0.203: U2.35 30.93,31.46 33,33.53 39.24,33.53 v40.77,35.05
  Bottom 0.254: v40.77,35.05 42.16,36.45 48.01,36.45 50.29,34.16 50.29,10.29 49.02,9.02 46.48,9.02 44.58,10.92 32.38,10.92 31.24,9.78 31.24,4.32 29.34,2.41 26.8,2.41 23.24,5.97 22.48,5.97 20.32,3.81 J2.P$5
LORA_MISO
  Top 0.254: U2.14 24.55,25.18 11.43,12.06 11.43,6.35 J2.P$3
LORA_MOSI
  Top 0.254: U2.15 25.05,24.92 12.06,11.94 12.06,8.26 J2.P$4
LORA_NSS
  Top 0.254: U2.12 23.35,25.51 10.16,12.32 J2.P$1
LORA_SCK
  Top 0.254: U2.13 24.05,25.44 10.79,12.19 10.79,4.45 J2.P$2
N$1
  Top 0.254: Q2.3 20.19,57.15 17.91,59.44 D3.2
N$2
  Top 0.254: C9.2 28.62,22.82 27.94,22.14 L3.2 | C9.2 29.41,22.82 L4.1 | U2.23 29.05,22.86 C9.2
N$3
  Top 0.254: C14.2 L5.1 26.25,18.63 26.67,19.05 26.67,22.35 28.05,23.73 U2.21
N$4
  Top 0.254: U2.47 24.55,33.24 21.72,36.07 L6.2
N$5  (via drill 0.35)
  Top 0.254: R2.2 25.06,5.08 v22.86,5.08 | v39.24,35.05 38.48,34.29 37.21,34.29 35.94,35.56 31.37,35.56 29.05,33.24 U2.38
  Bottom 0.254: v39.24,35.05 41.27,37.08 48.13,37.08 50.93,34.29 50.93,10.03 49.28,8.38 46.23,8.38 44.32,10.29 32.64,10.29 31.88,9.53 31.88,4.06 29.59,1.78 26.16,1.78 v22.86,5.08
N$6
  Top 0.254: Q3.1 18.41,51.94 22.13,51.94 D6.1 22.83,51.94 24.43,51.94 R7.2
N$7
  Top 0.254: D1.2 4.05,61.35 3.17,62.23 3.17,68.58 J5.P$1
N$8  (via drill 0.35)
  Top 0.254: v37.85,35.05 36.83,36.07 31.23,36.07 28.55,33.38 U2.39 | v33.15,9.4 R1.2
  Bottom 0.254: v37.85,35.05 40.51,37.72 48.39,37.72 51.56,34.54 51.56,9.78 49.53,7.75 45.85,7.75 44.2,9.4 v33.15,9.4
N$9
  Top 0.254: Q1.1 34.33,11.98 R1.1
N$10  (via drill 0.35)
  Top 0.254: U5.3 40.52,44.68 C32.1 42.19,44.93 43.39,43.73 C34.1 v44.58,48.01
  Bottom 0.254: S1.P$1 29.97,74.3 46.48,74.3 48.9,71.88 48.9,52.32 v44.58,48.01
N$12
  Top 0.254: J7.2 41.92,7.23 40.39,8.76 34.3,8.76 | Q1.2 34.3,10.17 34.3,8.76 | J10.2 34.3,8.76
N$23
  Top 0.254: D3.1 D4.1 23.87,63.5 L8.P$1
N$24
  Top 0.254: U3.8 22.86,53.34 24.36,54.84 R6.1 27.56,56.39 30.57,59.4 L8.P$2
N$25
  Top 0.254: C30.1 48.68,56.43 47.74,55.49 D5.1 46.08,55.09 43.05,55.09 C31.1 41.4,54.74 36.2,49.53 34.42,49.53 | Q3.2 18.29,49.91 18.67,49.53 34.42,49.53 | U5.2 U5.4 34.43,49.52 34.42,49.53
N$26
  Top 0.254: U3.10 16.22,55.34 17.65,56.77 Q2.1
N$27
  Top 0.254: R3.1 7.84,50 9.18,51.34 U3.5
N$28
  Top 0.254: C25.1 6.81,51.65 R3.2
N$31
  Top 0.254: C26.2 10.11,55.33 U3.1
N$32
  Top 0.254: R4.1 R5.2 3.13,55.33 2.54,54.74 2.54,49.4 3.56,48.39 13.09,48.39 15.54,50.83 U3.6
N$33
  Top 0.254: R8.2 50.25,50.25 51.05,51.05 51.05,57.15 50.04,58.17 42.67,58.17 41.53,59.31 41.53,60.71 41.27,60.96 U6.2
N$34
  Top 0.254: U6.3 U4.4
N$35
  Top 0.254: U4.6 U6.1
N$37
  Top 0.254: R14.1 C33.2 44.87,60.41 44.32,60.96 U6.5
N$49
  Top 0.254: J1.1 26.8,4.83 27.18,5.21 L1.1 C1.1
N$50
  Top 0.254: L1.2 C3.1 C2.1
N$51
  Top 0.254: U1.3 27.12,9.5 C3.2
N$52
  Top 0.254: C6.2 23.62,6.9 R2.1 26.08,6.9 26.47,7.29 U1.2
N$53
  Top 0.254: U1.12 25.82,16.17 C14.1
N$54
  Top 0.254: U1.9 27.77,16.17 L2.1 C5.1
N$55
  Top 0.254: L2.2 C7.1
N$56
  Top 0.254: C9.1 28.83,20.87 C8.1 C7.2 L3.1
NRST  (via drill 0.35)
  Top 0.254: J3.12 v10.41,36.96 | U2.18 26.55,24.13 23.5,21.08 C17.1 23.03,19.73 21.59,18.29 v21.59,17.27
  Bottom 0.254: v10.41,36.96 10.41,30.99 21.59,19.81 v21.59,17.27
OSC_IN
  Top 0.254: U2.26 33.82,26.96 34.28,26.5 C10.1 37.55,26.5 37.91,26.86 Y1.1
OSC_OUT
  Top 0.254: U2.27 33.68,27.46 35.18,28.96 C11.1 Y1.3
PA0
  Top 0.254: U2.7 12.83,28.96 9.02,25.15 9.02,21.59 J2B.P$4
PA11
  Top 0.203: U2.34 30.97,30.96 33.16,33.15 40.14,33.15 44.08,29.21 J2A.P$8
PA15  (via drill 0.35)
  Top 0.254: U2.43 26.55,33.98 27.43,34.87 v27.43,35.43
  Bottom 0.254: v27.43,35.43 28.57,34.29 32.26,34.29 32.89,33.66 46.48,33.66 J2A.P$10
PB0
  Top 0.203: U2.30 31.88,28.96 34.04,31.11 39.24,31.11 44.32,26.04 44.32,21.84 J2A.P$4
PB8
  Top 0.254: U2.6 12.57,29.46 8.51,25.4 8.51,23.62 J2B.P$5
PB12
  Top 0.203: U2.32 31.36,29.96 33.53,32.13 39.75,32.13 45.59,26.29 45.59,25.65 J2A.P$6
PC15
  Top 0.254: J2A.P$9 45.97,31.75 41.15,36.58 31.11,36.58 28.05,33.51 U2.40
RFI_3
  Top 0.254: C12.1 L5.2 25.78,22.35 27.55,24.12 U2.20
SPI_CLK
  Top 0.254: U2.8 13.09,28.46 9.53,24.89 9.53,19.56 J2B.P$3
SPI_CS
  Top 0.203: U2.31 31.62,29.46 33.78,31.62 39.5,31.62 44.96,26.16 44.96,23.75 J2A.P$5
SPI_MISO
  Top 0.254: U2.2 6.77,31.46 J2B.P$9
SPI_MOSI
  Top 0.254: U2.3 11.78,30.96 10.03,29.21 J2B.P$8
SWCLK  (via drill 0.35)
  Top 0.254: U2.42 27.05,33.78 28.45,35.18 v28.45,35.94 | v14.22,35.81 J3.06
  Bottom 0.254: v28.45,35.94 27.56,36.83 23.24,36.83 22.23,35.81 v14.22,35.81
SWDIO  (via drill 0.35)
  Top 0.203: v35.18,34.67 33.53,34.67 30.82,31.96 U2.36
  Top 0.254: J3.04 v15.49,36.83
  Bottom 0.254: v15.49,36.83 21.72,36.83 22.61,37.72 32.13,37.72 v35.18,34.67
UART_RX
  Top 0.254: U2.10 13.62,27.46 10.54,24.38 10.54,15.49 J2B.P$1
UART_TX
  Top 0.254: U2.9 13.36,27.96 10.03,24.64 10.03,17.53 J2B.P$2
VDC  (via drill 0.35)
  Top 0.254: R4.2 C26.1 | D6.2 21.87,54.74 18.41,54.74 Q2.2 17.4,54.99 16.75,54.34 U3.9 14.49,54.34 12.4,56.43 | C26.1 12.4,56.43 | D5.2 v46.61,48.01 | D1.1 7.37,65.65 | 7.37,65.65 9.89,65.65 C23.1 v12.57,65.25 14.6,65.25 C27.1 C24.1 | 12.4,56.43 | C26.1 7.37,65.65
  Bottom 0.254: v46.61,48.01 49.53,50.93 49.53,61.34 49.53,72.14 46.74,74.93 14.99,74.93 12.57,72.52 v12.57,65.25
VDDA
  Top 0.254: U2.41 27.55,33.64 29.34,35.43 C21.1 | L7.2 27.22,42.63 C21.1 | C21.1 C22.1
VR_PA1
  Top 0.254: C13.1 C15.1 L4.2 31.11,22.99 29.55,24.55 U2.24
VREG1  (via drill 0.35)
  Top 0.254: U2.29 32.4,28.46 v33.15,29.21 | U2.45 25.55,33.92 25.07,34.39 25.07,35 v24.13,35.94 24.13,42.5 C16.2 23.79,42.63 22.44,43.98 L6.1
  Bottom 0.254: v24.13,35.94 23.24,35.05 23.24,34.42 24.77,32.89 30.48,32.89 33.15,30.23 v33.15,29.21

### Text on the board
tPlace: DC IN (4-20V) | 3V3 | SWITCH | BATTERY | + | - | + | - | + | - | DEBUG | ADC | PA15 | SPI MISO | PC15 | SPI MOSI | PA11 | I2C SCK | DAC | I2C SDA | PB12 | NSE LABS, LLC | COMSTATION revA.1 | PB8 | SPI CS | PA0 | PB0 | SPI CLK | GND | UART TX | GND | I2C SDA | I2C SCK | GND | UART RX | 3V3 | LoRa DEBUG | NSS | SCK | MISO | MOSI | BUSY